# EAGLE design FinalAQsensors (EAGLE 9.3.1)
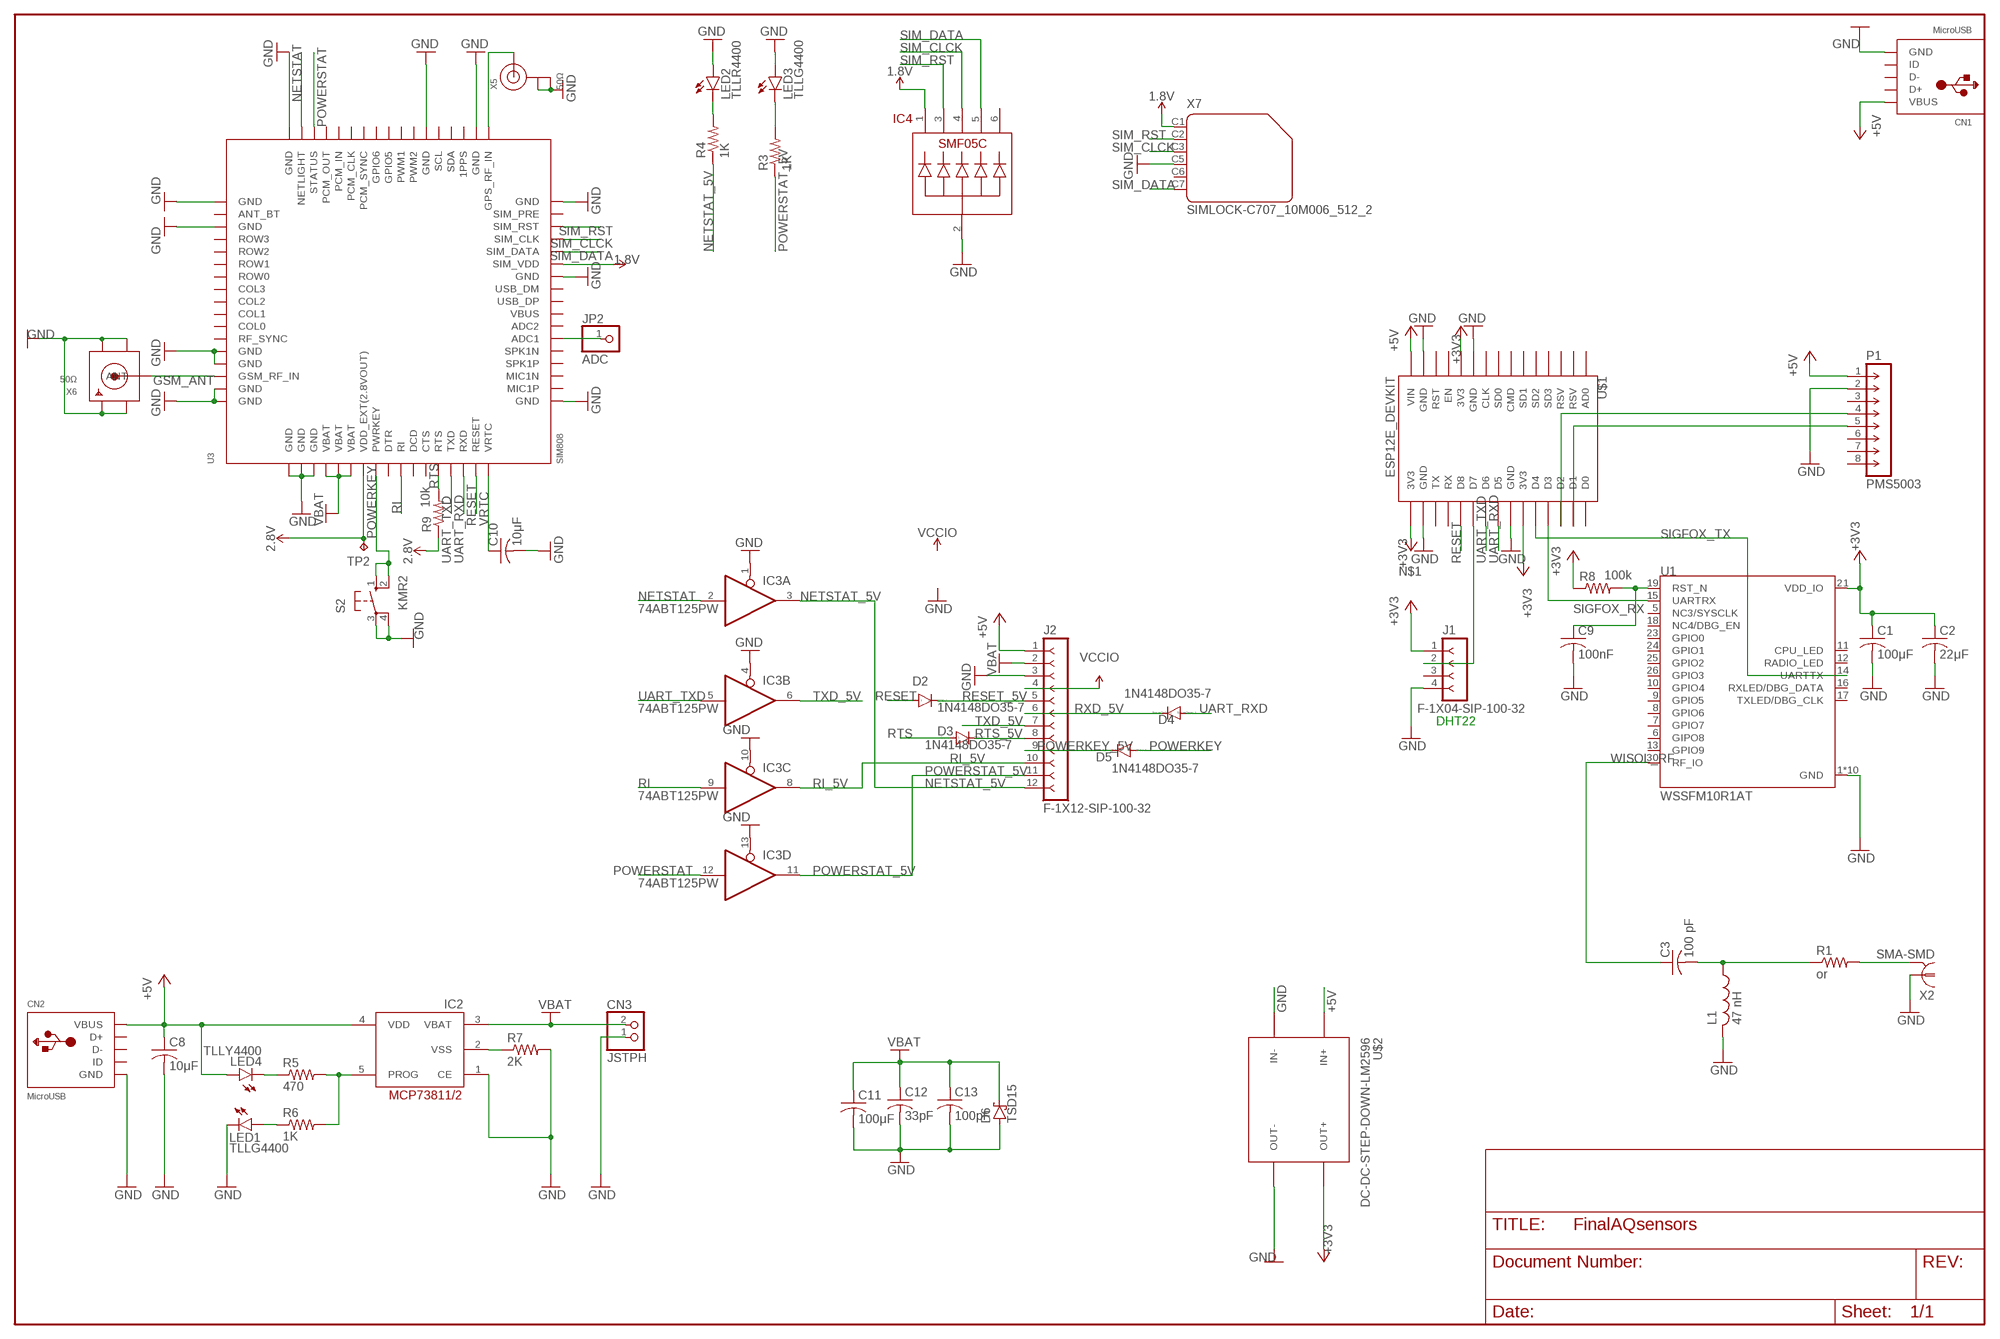
[diagram p0: schematic, sheet 1]

## Parts
C1  100μF  C-USC0201  [C0201]
C2  22μF  C-USC0201  [C0201]
C3  100 pF  C-USC0201  [C0201]
C8  10μF  C-US025-025X050  [C025-025X050]
C9  100nF  C-US025-025X050  [C025-025X050]
C10  10μF  C-USC0402  [C0402]
C11  100μF  C-USC0402  [C0402]
C12  33pF  C-USC0402  [C0402]
C13  100pF  C-USC0402  [C0402]
CN1  MicroUSB  USBMINIB  [USB-MINIB]
CN2  MicroUSB  USBMINIB  [USB-MINIB]
CN3  JSTPH  JST_2PIN-SMT  [JST-PH-2-SMT]
D2  1N4148DO35-7  [DO35-7]
D3  1N4148DO35-7  [DO35-7]
D4  1N4148DO35-7  [DO35-7]
D5  1N4148DO35-7  [DO35-7]
D6  TSD15  [CB429-15]
IC2  MCP73811/2  [SOT23-5L]
IC3  74ABT125PW  [TSSOP14]
IC4  SMF05C  [SC-70-6]
J1  F-1X04-SIP-100-32  [SIP-100-04-32]
J2  F-1X12-SIP-100-32  [SIP-100-12-32]
JP2  ADC  PINHD-1X01_2.00  [1X01M]
L1  47 nH  L-US0204/7  [0204/7]
LED1  TLLG4400  [LED3MM]
LED2  TLLR4400  [LED3MM]
LED3  TLLG4400  [LED3MM]
LED4  TLLY4400  [LED3MM]
P1  PMS5003  M-1X08-SIP-100-40  [SIP-100-08-40]
R1  or  R-US_0204/5  [0204/5]
R3  1K  R-US_0204/5  [0204/5]
R4  1K  R-US_0204/5  [0204/5]
R5  470  R-US_0204/5  [0204/5]
R6  1K  R-US_0204/5  [0204/5]
R7  2K  R-US_0204/5  [0204/5]
R8  100k  R-US_0204/7  [0204/7]
R9  10k  R-US_0204/5  [0204/5]
S2  KMR2  40/XX  [B3F/40XX]
TP2  TPTP10R  [TP10R]
U1  WSSFM10R1AT  [XCVR_WSSFM10R1AT]
U3  SIM808  GSM_SIM808_LITERAL  [SIM900_SMT]
U$1  ESP12E_DEVKIT  [ESP12E_DEVKIT]
U$2  DC-DC-STEP-DOWN-LM2596  [DC-DC-STEP-DOWN-LM2596]
X2  SMA-SMD  [SMA-SMD]
X5  50Ω  ANTENNA_U.FL  [U.FL]
X6  50Ω  SMACONNECTOR_EDGE_UFL  [SMA_EDGELAUNCH_UFL]
X7  SIMLOCK-C707_10M006_512_2  [C707_10M006_512_2]

## Nets
1.8V: IC4.1 U3.P$29(SIM_VDD) X7.C1
2.8V: R9.1 TP2.TP U3.P$7(VDD_EXT(2.8VOUT))
+3V3: C1.1 C2.1 J1.1 R8.1 U1.21(VDD_IO) U$1.3V3@0(3V3) U$1.3V3@1(3V3) U$1.3V3@2(3V3) U$2.OUT+
+5V: C8.1 CN1.VBUS CN2.VBUS IC2.4(VDD) J2.1 LED4.A P1.1 U$1.VIN U$2.IN+
GND [GND]: C1.2 C2.2 C8.2 C9.2 C10.2 C11.2 C12.2 C13.2 CN1.GND CN2.GND CN3.1 D6.A IC2.1(CE) IC3.1(A:OE) IC3.4(B:OE) IC3.10(C:OE) IC3.13(D:OE) IC4.2 J1.4 J2.3 L1.2 LED1.K(C) LED2.A LED3.A P1.2 R7.2 S2.3(P) S2.4(P1) U1.1(GND) U1.2(GND) U1.3(GND) U1.4(GND) U1.20(GND) U1.22(GND) U1.27(GND) U1.28(GND) U1.29(GND) U1.31(GND) U3.P$1(GND) U3.P$2(GND) U3.P$3(GND) U3.P$18(GND) U3.P$28(GND) U3.P$34(GND) U3.P$36(GND) U3.P$40(GND) U3.P$51(GND) U3.P$52(GND) U3.P$54(GND) U3.P$64(GND) U3.P$65(GND) U3.P$67(GND) U3.P$68(GND) U$1.GND@0(GND) U$1.GND@1(GND) U$1.GND@2(GND) U$1.GND@3(GND) U$2.IN- U$2.OUT- X2.1 X5.1(GND) X5.2(GND) X6.GND@1(GND1) X6.GND@2(GND2) X6.GND@3(GND3) X6.GND@4(GND4) X7.C5
GSM_ANT: U3.P$66(GSM_RF_IN) X6.P(ANT)
N$1: J1.2 U$1.D7
N$2: C9.1 R8.2 U1.19(RST_N)
N$3: P1.4 U$1.D2
N$4: P1.5 U$1.D1
N$5: C3.2 L1.1 R1.1
N$6: U3.P$35(GPS_RF_IN) X5.3(SIGNAL)
N$12: R1.2 X2.2@1 X2.2@2 X2.2@3 X2.2@4 X2.2@5 X2.2@6
N$13: JP2.1 U3.P$23(ADC1)
N$18: LED2.K(C) R4.2
N$21: LED3.K(C) R3.2
N$35: LED4.K(C) R5.1
N$36: IC2.5(PROG) R5.2 R6.2
N$37: LED1.A R6.1
NETSTAT: IC3.2(A:I) U3.P$50(NETLIGHT)
NETSTAT_5V: IC3.3(A:O) J2.12 R4.1
POWERKEY: D5.A S2.1(S) S2.2(S1) U3.P$8(PWRKEY)
POWERKEY_5V: D5.C J2.9
POWERSTAT: IC3.12(D:I) U3.P$49(STATUS)
POWERSTAT_5V: IC3.11(D:O) J2.11 R3.1
RESET: D2.A U3.P$16(RESET) U$1.D8
RESET_5V: D2.C J2.5
RI: IC3.9(C:I) U3.P$10(RI)
RI_5V: IC3.8(C:O) J2.10
RTS: D3.A R9.2 U3.P$13(RTS)
RTS_5V: D3.C J2.8
RXD_5V: D4.C J2.6
SIGFOX_RX: U1.15(UARTRX) U$1.D3
SIGFOX_TX: U1.14(UARTTX) U$1.D4
SIM_CLCK: IC4.4 U3.P$31(SIM_CLK) X7.C3
SIM_DATA: IC4.5 U3.P$30(SIM_DATA) X7.C7
SIM_RST: IC4.3 U3.P$32(SIM_RST) X7.C2
TXD_5V: IC3.6(B:O) J2.7
UART_RXD: D4.A U3.P$15(RXD) U$1.D5
UART_TXD: IC3.5(B:I) U3.P$14(TXD) U$1.D6
VBAT: C11.1 C12.1 C13.1 CN3.2 D6.C IC2.3(VBAT) J2.2 U3.P$4(VBAT) U3.P$5(VBAT) U3.P$6(VBAT)
VCCIO: J2.4
VRTC: C10.1 U3.P$17(VRTC)
VSS: IC2.2(VSS) R7.1
WISOL_RF: C3.1 U1.30(RF_IO)
Unconnected: CN1.D+ CN1.D- CN1.ID CN2.D+ CN2.D- CN2.ID IC4.6 J1.3 P1.3 P1.6 P1.7 P1.8 U1.5(NC3/SYSCLK) U1.6(GIPO8) U1.7(GPIO7) U1.8(GPIO6) U1.9(GPIO5) U1.10(GPIO4) U1.11(CPU_LED) U1.12(RADIO_LED) U1.13(GPIO9) U1.16(RXLED/DBG_DATA) U1.17(TXLED/DBG_CLK) U1.18(NC4/DBG_EN) U1.23(GPIO0) U1.24(GPIO1) U1.25(GPIO2) U1.26(GPIO3) U3.P$9(DTR) U3.P$11(DCD) U3.P$12(CTS) U3.P$19(MIC1P) U3.P$20(MIC1N) U3.P$21(SPK1P) U3.P$22(SPK1N) U3.P$24(ADC2) U3.P$26(USB_DP) U3.P$27(USB_DM) U3.P$33(SIM_PRE) U3.P$37(1PPS) U3.P$38(SDA) U3.P$39(SCL) U3.P$41(PWM2) U3.P$42(PWM1) U3.P$43(GPIO5) U3.P$44(GPIO6) U3.P$45(PCM_SYNC) U3.P$46(PCM_CLK) U3.P$47(PCM_IN) U3.P$48(PCM_OUT) U3.P$53(ANT_BT) U3.P$55(ROW3) U3.P$56(ROW2) U3.P$57(ROW1) U3.P$58(ROW0) U3.P$59(COL3) U3.P$60(COL2) U3.P$61(COL1) U3.P$62(COL0) U3.P$63(RF_SYNC) U$1.AD0 U$1.CLK U$1.CMD U$1.D0 U$1.EN U$1.RST U$1.RSV@0(RSV) U$1.RSV@1(RSV) U$1.RX U$1.SD0 U$1.SD1 U$1.SD2 U$1.SD3 U$1.TX X7.C6

## Notes on the sheet
- DHT22

## Power pins joined to a net without a drawn wire
GND: IC3.7(P:GND)
VBUS: U3.P$25(VBUS)
VCC: IC3.14(P:VCC)

## Library data of the parts
C1-C3 C9-C13 = rcl:C-US: CAPACITOR, American symbol; SPICEPREFIX: C
C8 = adafruit:C-US: CAPACITOR, American symbol
CN1 CN2 = adafruit:USB: USB Connectors USBMINIB - Surface Mount Female Mini-B USB Connector 4UConnector: 06564 By microbuilder.eu Thru-hole RA Female Mini-B USB Connector 4UConnector: 18732 By ladyada.net
CN3 = adafruit:JST_2PIN: JST 2-Pin Connectors of various flavors SMT-RA (S2B-PH-SM4) 4UConnector #17311 SMT (B2B-PH-SM4) THM-RA (S2B-PH) THM (B2B-PH)
D2-D5 = diode:1N4148: DIODE high speed (Philips)
D6 = diode:TSD15: DIODE
IC2 = adafruit:MCP73811/2: MCP73811 and MCP73812 Simple, Miniature Single-Cell, Fully Integrated Li-Ion / Li-Polymer Charge Management Controllers SOT-23-5 package, no indicator LED but with adjustable current, small and very inexpensive
IC3 = 74xx-eu:74*125: Quad bus BUFFER, 3-state
IC4 = smf05c:SMF05C
J1 = con-headers-jp:F-1X04-: FEMALE HEADER
J2 = con-headers-jp:F-1X12-: FEMALE HEADER
JP2 = pinhead-2:PINHD-1X01: PIN HEADER
L1 = rcl:L-US: INDUCTOR, American symbol; SPICEPREFIX: L
LED1 LED3 = led:TLLG4400: Low Current (2mA) LED 3 mm Tinted Diffused Package color GREEN Source: Data sheet <http://www.farnell.com/datasheets/391098.pdf>; MF: VISHAY SEMICONDUCTOR; OC_FARNELL: 1612435
LED2 = led:TLLR4400: Low Current (2mA) LED 3 mm Tinted Diffused Package color RED Source: Data sheet <http://www.farnell.com/datasheets/391100.pdf>; MF: VISHAY SEMICONDUCTOR; OC_FARNELL: 1612437
LED4 = led:TLLY4400: Low Current (2mA) LED 3 mm Tinted Diffused Package color YELLOW Source: Data sheet <http://www.farnell.com/datasheets/391098.pdf>; MF: VISHAY SEMICONDUCTOR; OC_FARNELL: 1612439
P1 = con-headers-jp:M-1X08-: MALE HEADER
R1 R3-R9 = rcl:R-US_: RESISTOR, American symbol; SPICEPREFIX: R
S2 = switch-omron:40/XX: OMRON SWITCH; OC_FARNELL: unknown; OC_NEWARK: unknown
TP2 = testpad:TP: Test pad
U1 = WSSFM10R1AT:WSSFM10R1AT: Sigfox RF Module, Sub-1GHz , SMD; AVAILABILITY: Unavailable; DESCRIPTION: Sigfox Module Rcz1 At Version; MF: Avnet Design Services; MP: WSSFM10R1AT; PACKAGE: None; PRICE: None
U3 = adafruit:GSM_SIM808_LITERAL: SIM808 GSM Module
U$1 = ESP12E_DEVKIT:ESP12E_DEVKIT: ESP12E DEVKIT BOARD
U$2 = diy-modules:DC-DC-STEP-DOWN-LM2596: DC/DC Step-Down Regulator based on LM2596-ADJ chip LM2596 datasheet available here: http://www.ti.com/lit/ds/symlink/lm2596.pdf Click here to find device on ebay.com <http://www.ebay.com/sch/lm2596+power+regulator>
X2 = con-coax:SMA-SMD: SMA 50 Ohm Straight Jack Receptacle - Surface Mount www.johnsoncomponents.com Source: http://catalog.digikey.com .. 142-0711-201, 205, 202, 206.pdf; OC_FARNELL: unknown; OC_NEWARK: unknown
X5 = adafruit:ANTENNA_U.FL: U.FL Antenna Connector
X6 = adafruit:SMACONNECTOR: SMA Connector 90° DIP SMA Connector, 50 Ohm (4UConnector: 07259)
X7 = con-amphenol:SIMLOCK-C707_10M006_512_2: C707A SIMLOCK® 2.5 mm with wide solder tails Source: Data sheet <http://www.amphenol.info/downloads/C707_10M006_512_2.pdf>; OC_FARNELL: unknown; OC_NEWARK: unknown

## Net classes
1 POWER: width 0.508 mm
2 GND: width 0.254 mm

## Board
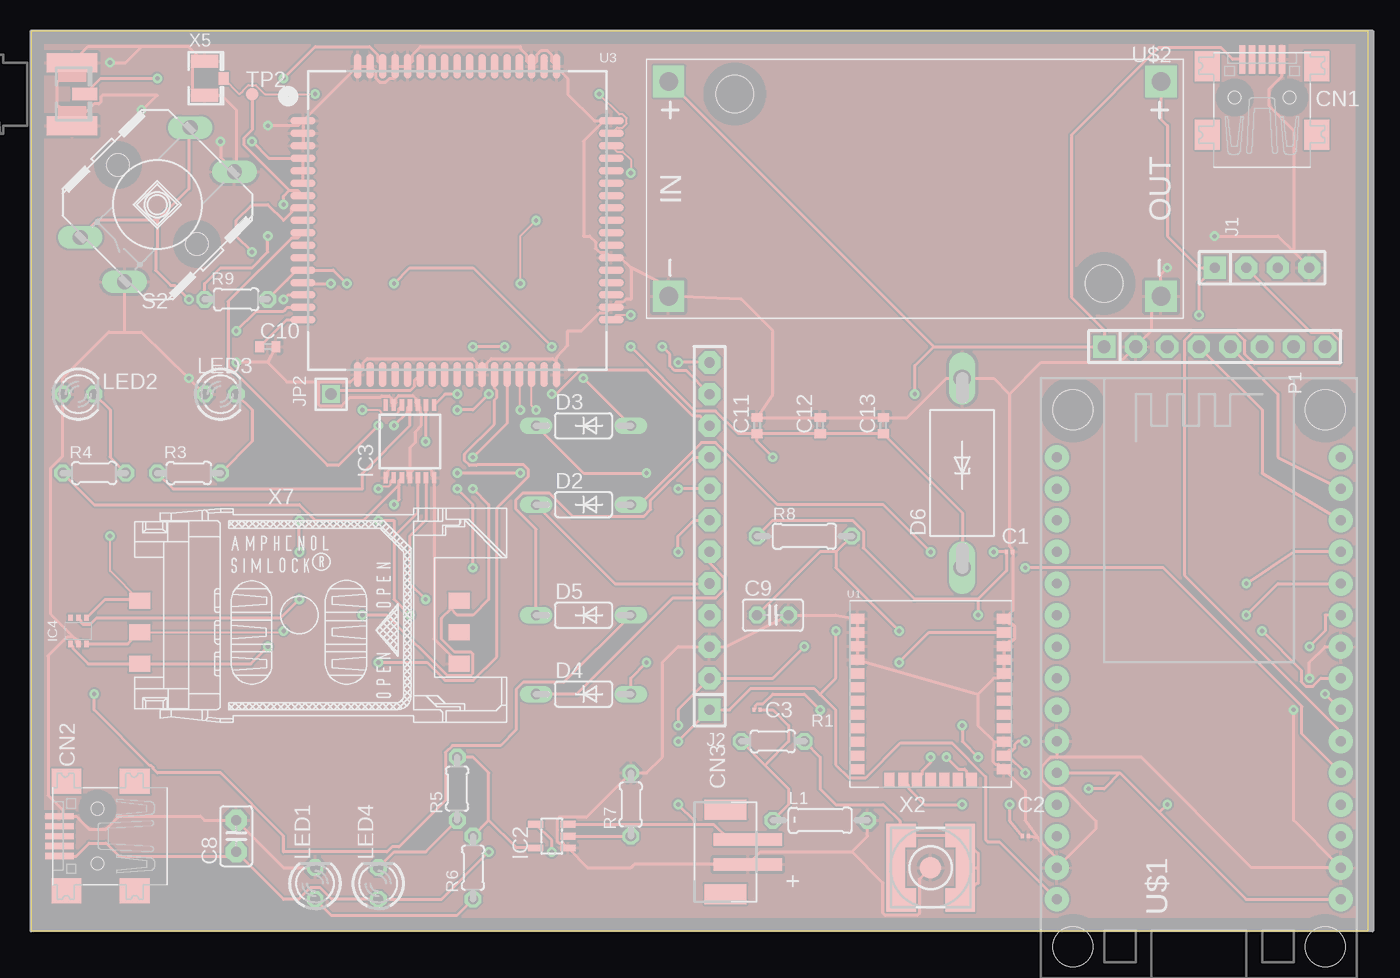
[diagram p1: board, top side]
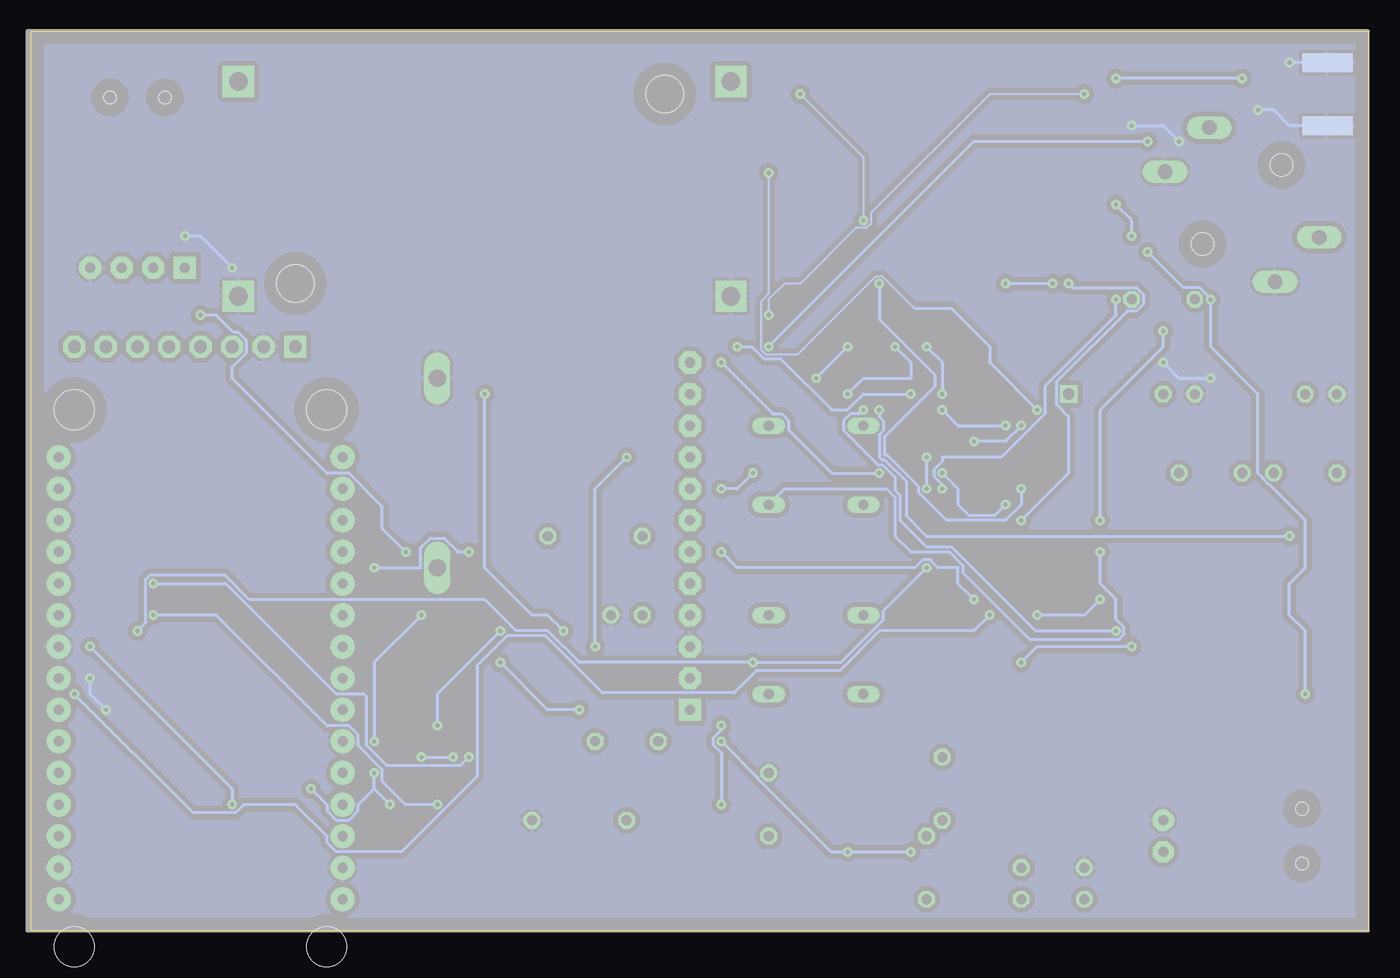
[diagram p2: board, bottom side, seen from below]

Size 107.62 x 72.38 mm. Coordinates in mm from the lower left corner, seen from the top.
Outline: 0,0 107.62,0 107.62,72.38 0,72.38 0,0
Copper layers (1*16): Top 0.035mm / dielectric 1.5mm / Bottom 0.035mm
Design rules "default": minimum track width 6mil, minimum drill 0.35mm, track to track 6mil, track to pad 6mil, pad to pad 6mil, via to via 6mil, smd to smd 6mil, copper to edge 40mil, drill to drill 6mil, minimum pad ring 10mil, minimum via ring 8mil, stop-mask expansion 4mil, vias tented up to drill 0mil, thermal gap 10mil

### Footprints (pad centres in the part's own frame; a part is rotated, then mirrored left to right if it is on the bottom)
C0201 = smd 0.25 x 0.35: 1 -0.25,0; 2 0.25,0
C025-025X050 = drill 0.813 pad 1.676 octagon: 1 -1.27,0; 2 1.27,0
C025-025X050' = drill 0.813 octagon: 1 -1.27,0; 2 1.27,0
C0402 = smd 0.7 x 0.9: 1 -0.65,0; 2 0.65,0
USB-MINIB = smd 0.5 x 2.308: D+ 0,4.064; D- -0.8,4.064; GND 1.6,4.064; ID 0.8,4.064; VBUS -1.6,4.064 | smd 2 x 2.4: GND1 -4.4,-2; GND2 -4.4,3.5; GND3 4.4,3.5; GND4 4.4,-2 | hole 1: -2.2,1; 2.2,1
JST-PH-2-SMT = smd 1 x 5.5: 1 -1,-1.8; 2 1,-1.8 | smd 1.6 x 3.4: NC1 -3.4,0; NC2 3.4,0
DO35-7 = drill 0.813 long: A 3.81,0; C -3.81,0
CB429-15 = drill 1.397 long: A 7.62,0; C -7.62,0
SOT23-5L = smd 0.55 x 1.2: 1 -0.95,-1.3; 2 0,-1.3; 3 0.95,-1.3; 4 0.95,1.3; 5 -0.95,1.3
TSSOP14 = smd 0.35 x 0.9: 1 -1.95,-2.925; 2 -1.3,-2.925; 3 -0.65,-2.925; 4 0,-2.925; 5 0.65,-2.925; 6 1.3,-2.925; 7 1.95,-2.925; 8 1.95,2.925; 9 1.3,2.925; 10 0.65,2.925; 11 0,2.925; 12 -0.65,2.925; 13 -1.3,2.925; 14 -1.95,2.925
SC-70-6 = smd 0.35 x 0.5: 1 -0.65,-1.05; 2 0,-1.05; 3 0.65,-1.05; 4 0.65,1.05; 5 0,1.05; 6 -0.65,1.05
SIP-100-04-32 = drill 0.813 pad 1.778 square: 1 -3.81,0 | drill 0.813 pad 1.778 octagon: 2 -1.27,0; 3 1.27,0; 4 3.81,0
SIP-100-12-32 = drill 0.813 pad 1.778 square: 1 -13.97,0 | drill 0.813 pad 1.778 octagon: 2 -11.43,0; 3 -8.89,0; 4 -6.35,0; 5 -3.81,0; 6 -1.27,0; 7 1.27,0; 8 3.81,0; 9 6.35,0; 10 8.89,0; 11 11.43,0; 12 13.97,0
1X01M = drill 0.914 square: 1 0,0
0204/7 = drill 0.813 octagon: 1 -3.81,0; 2 3.81,0
LED3MM = drill 0.813 octagon: A -1.27,0; K 1.27,0
SIP-100-08-40 = drill 1.016 pad 1.778 square: 1 -8.89,0 | drill 1.016 pad 1.778 octagon: 2 -6.35,0; 3 -3.81,0; 4 -1.27,0; 5 1.27,0; 6 3.81,0; 7 6.35,0; 8 8.89,0
0204/5 = drill 0.813 octagon: 1 -2.54,0; 2 2.54,0
B3F/40XX = drill 1.194 long: 1 -6.198,-2.642; 2 2.642,6.198; 3 -2.642,-6.198; 4 6.198,2.642 | hole 1.803: -3.175,3.175; 3.175,-3.175
TP10R = smd 1 x 1: TP 0,0
XCVR_WSSFM10R1AT = smd 1.15 x 0.81: 1 -5.9,6.05; 2 -5.9,4.95; 3 -5.9,3.85; 4 -5.9,2.75; 5 -5.9,1.65; 6 -5.9,0.55; 7 -5.9,-0.55; 8 -5.9,-1.65; 9 -5.9,-2.75; 10 -5.9,-3.85; 11 -5.9,-4.95; 12 -5.9,-6.05; 20 5.9,-6.05; 21 5.9,-4.95; 22 5.9,-3.85; 23 5.9,-2.75; 24 5.9,-1.65; 25 5.9,-0.55; 26 5.9,0.55; 27 5.9,1.65; 28 5.9,2.75; 29 5.9,3.85; 30 5.9,4.95; 31 5.9,6.05 | smd 0.81 x 1.15: 13 -3.3,-6.9; 14 -2.2,-6.9; 15 -1.1,-6.9; 16 0,-6.9; 17 1.1,-6.9; 18 2.2,-6.9; 19 3.3,-6.9
SIM900_SMT = smd 2 x 0.6: P$1 -12.4,8; P$2 -12.4,7; P$3 -12.4,6; P$4 -12.4,5; P$5 -12.4,4; P$6 -12.4,3; P$7 -12.4,2; P$8 -12.4,1; P$9 -12.4,0; P$10 -12.4,-1; P$11 -12.4,-2; P$12 -12.4,-3; P$13 -12.4,-4; P$14 -12.4,-5; P$15 -12.4,-6; P$16 -12.4,-7; P$17 -12.4,-8; P$35 12.4,-8; P$36 12.4,-7; P$37 12.4,-6; P$38 12.4,-5; P$39 12.4,-4; P$40 12.4,-3; P$41 12.4,-2; P$42 12.4,-1; P$43 12.4,0; P$44 12.4,1; P$45 12.4,2; P$46 12.4,3; P$47 12.4,4; P$48 12.4,5; P$49 12.4,6; P$50 12.4,7; P$51 12.4,8 | smd 0.6 x 2: P$18 -8,-12.4; P$19 -7,-12.4; P$20 -6,-12.4; P$21 -5,-12.4; P$22 -4,-12.4; P$23 -3,-12.4; P$24 -2,-12.4; P$25 -1,-12.4; P$26 0,-12.4; P$27 1,-12.4; P$28 2,-12.4; P$29 3,-12.4; P$30 4,-12.4; P$31 5,-12.4; P$32 6,-12.4; P$33 7,-12.4; P$34 8,-12.4; P$52 8,12.4; P$53 7,12.4; P$54 6,12.4; P$55 5,12.4; P$56 4,12.4; P$57 3,12.4; P$58 2,12.4; P$59 1,12.4; P$60 0,12.4; P$61 -1,12.4; P$62 -2,12.4; P$63 -3,12.4; P$64 -4,12.4; P$65 -5,12.4; P$66 -6,12.4; P$67 -7,12.4; P$68 -8,12.4
ESP12E_DEVKIT = drill 0.8 pad 1.93: 3V3@0 -11.43,-7.62; 3V3@1 11.43,5.08; 3V3@2 11.43,-17.78; AD0 -11.43,17.78; CLK -11.43,-2.54; CMD -11.43,2.54; D0 11.43,17.78; D1 11.43,15.24; D2 11.43,12.7; D3 11.43,10.16; D4 11.43,7.62; D5 11.43,0; D6 11.43,-2.54; D7 11.43,-5.08; D8 11.43,-7.62; EN -11.43,-10.16; GND@0 -11.43,-5.08; GND@1 -11.43,-15.24; GND@2 11.43,2.54; GND@3 11.43,-15.24; RST -11.43,-12.7; RSV@0 -11.43,15.24; RSV@1 -11.43,12.7; RX 11.43,-10.16; SD0 -11.43,0; SD1 -11.43,5.08; SD2 -11.43,7.62; SD3 -11.43,10.16; TX 11.43,-12.7; VIN -11.43,-17.78 | hole 3.2: -10.16,21.59; 10.16,21.59; 10.16,-21.59; -10.16,-21.59
DC-DC-STEP-DOWN-LM2596 = drill 1.5 pad 2.5 square: IN+ -19.812,8.636; IN- -19.812,-8.636; OUT+ 19.812,8.636; OUT- 19.812,-8.636 | hole 3: -14.478,7.62; 15.24,-7.62
SMA-SMD = smd 1.73 x 1.73: 1 0,0 | smd 2.35 x 1.9: 2@1 -2.375,2.6; 2@2 -2.375,-2.6; 2@3 2.375,-2.6; 2@4 2.375,2.6 | smd 1.5 x 3.4: 2@5 -2.8,0; 2@6 2.8,0
U.FL = smd 2.2 x 1.05: 1 0,1.375; 2 0,-1.375 | smd 0.8 x 1: 3 1.525,0
SMA_EDGELAUNCH_UFL = smd 4.064 x 1.524: GND@1 2.032,-2.54; GND@2 2.032,2.54 | smd 4.064 x 1.524 bottom: GND@3 2.032,2.54; GND@4 2.032,-2.54 | smd 2.032 x 1.016: P 3.048,0
C707_10M006_512_2 = smd 1.7 x 1.3: C1 -12.85,-3.915; C2 -12.85,-1.375; C3 -12.85,1.165; C5 12.85,-3.915; C6 12.85,-1.375; C7 12.85,1.165

### Placement (x,y rotation side)
C1  78.74,30.48 0 top
C2  80.01,7.62 0 top
C3  58.42,17.78 0 top
C8  16.51,7.62 90 top
C9  100nF  [C025-025X050']  59.69,25.4 0 top
C10  19.05,46.99 0 top
C11  58.42,40.64 90 top
C12  63.5,40.64 90 top
C13  68.58,40.64 90 top
CN1  99.06,66.04 0 top
CN2  6.35,7.62 90 top
CN3  55.88,6.35 90 top
D2  44.45,34.29 0 top
D3  44.45,40.64 0 top
D4  44.45,19.05 0 top
D5  44.45,25.4 0 top
D6  74.93,36.83 90 top
IC2  41.91,7.62 90 top
IC3  30.48,39.37 0 top
IC4  3.81,24.13 0 top
J1  99.06,53.34 0 top
J2  54.61,31.75 90 top
JP2  24.13,43.18 0 top
L1  63.5,8.89 0 top
LED1  22.86,3.81 90 top
LED2  3.81,43.18 0 top
LED3  15.24,43.18 0 top
LED4  27.94,3.81 90 top
P1  95.25,46.99 0 top
R1  59.69,15.24 0 top
R3  12.7,36.83 0 top
R4  5.08,36.83 0 top
R5  34.29,11.43 90 top
R6  35.56,5.08 90 top
R7  48.26,10.16 90 top
R8  62.23,31.75 0 top
R9  16.51,50.8 0 top
S2  10.16,58.42 0 top
TP2  17.78,67.31 0 top
U1  72.39,19.05 0 top
U3  34.29,57.15 0 top
U$1  93.98,20.32 0 top
U$2  71.12,59.69 0 top
X2  72.39,5.08 0 top
X5  13.97,68.58 0 top
X6  1.27,67.31 0 top
X7  21.59,25.4 0 top

### Tracks (layer width: path | path; a pad name or v marks a point on that pad's centre or on a via)
1.8V  (via drill 0.35)
  Top 0.254: IC4.1 3.36,22.88 3.36,22.71 4.58,21.48 X7.C1 17.68,21.48 v19.05,22.86 | v27.94,21.59 31.86,21.59 33.31,20.15 35.57,20.15 37.49,22.06 37.49,34.02 40.03,36.56 40.03,37.1 39.64,37.49 35.88,37.49 35.83,37.44 35.29,37.44 34.9,37.83 34.9,38.37 37.29,40.76 37.29,42.71 37.49,42.91 37.49,43.45 37.29,43.65 U3.P$29
  Bottom 0.254: v19.05,22.86 26.67,22.86 v27.94,21.59
2.8V  (via drill 0.35)
  Top 0.254: U3.P$7 21.47,59.57 20.78,59.57 | TP2.TP 17.78,64.43 17.12,63.77 17.12,63.23 20.78,59.57 | R9.1 13.97,52.07 15.24,53.34 17.78,53.34 19.05,54.61 v19.05,55.88 | v20.32,58.42 20.32,59.11 20.78,59.57
  Bottom 0.254: v19.05,55.88 19.05,57.15 v20.32,58.42
+3V3  (via drill 0.35)
  Top 0.254: R8.1 59.69,33.02 66.1,33.02 66.98,32.14 66.98,30.81 71.12,26.67 76.2,26.67 | 76.2,26.67 78.49,28.96 C1.1 v77.47,30.48 | U$1.3V3@0 87.63,12.7 | 87.63,12.7 90.81,9.53 | 90.81,9.53 97.79,2.54 U$1.3V3@2 | U$1.3V3@1 104.14,25.4 104.14,24.13 v102.87,22.86 | U$2.OUT+ 90.93,65.28 91.44,64.77 91.44,55.88 93.98,53.34 J1.1 93.98,52.07 v93.98,49.53 | v91.44,10.16 90.81,9.53 | 87.63,12.7 86.36,11.43 v85.09,11.43 | v80.01,12.7 78.61,14.1 U1.21 78.71,14.52 78.98,14.52 79.14,14.68 79.14,14.95 79.43,15.24 v80.01,15.24 | 76.2,26.67 v76.2,25.4 | v78.74,10.16 78.74,8.89 C2.1
  Bottom 0.254: v102.87,22.86 91.44,11.43 v91.44,10.16 | v77.47,30.48 79.35,32.36 79.35,34.12 82.03,36.8 83.8,36.8 91.44,44.45 91.44,45.34 90.27,46.51 90.27,47.47 90.96,48.16 91.34,48.16 92.71,49.53 v93.98,49.53 | v78.74,10.16 80.01,11.43 | 80.01,11.43 v80.01,12.7 | v85.09,11.43 83.8,10.13 83.8,9.64 83.07,8.91 82.03,8.91 81.31,9.64 81.31,10.13 80.01,11.43 | v76.2,25.4 80.01,21.59 v80.01,15.24
+5V  (via drill 0.35)
  Top 0.254: U$1.VIN 77.92,7.17 76.98,7.17 76.82,7.33 76.82,12.4 74.1,15.11 69.98,15.11 67.18,12.32 65.8,12.32 64.73,13.38 64.73,17.78 63.48,19.03 | 63.48,19.03 63.01,19.5 57.93,19.5 56.2,17.78 J2.1 v52.07,15.24 | U$2.IN+ 72.64,46.99 | 72.64,46.99 P1.1 86.36,48.33 83.72,50.98 83.72,64.01 90.73,71.02 95.78,71.02 96.69,70.1 CN1.VBUS | v36.83,6.35 33.02,2.54 LED4.A 24.19,2.54 23.25,3.48 22.47,3.48 21.53,2.54 20.32,2.54 C8.1 16.18,6.02 7.07,6.02 6.03,7.06 4.67,7.06 3.63,6.02 CN2.VBUS | IC2.4 41.91,7.27 v41.91,6.35 | 63.48,19.03 64.77,20.32 v64.77,24.13 | v71.12,43.18 71.12,45.47 72.64,46.99
  Bottom 0.254: v52.07,15.24 49.2,12.37 49.2,12.31 43.24,6.35 v41.91,6.35 v36.83,6.35 | v64.77,24.13 66.04,25.4 67.31,25.4 71.12,29.21 v71.12,43.18
GND  (via drill 0.35)
  Top 0.254: 78.74,43.18 77.47,44.45 D6.A 73.66,44.45 70.5,41.29 C13.2 C12.2 C11.2 59.69,43.18 59.69,48.26 57.15,50.8 U$2.IN- 50.8,52.07 48.26,53.34 | 78.74,43.18 78.74,30.93 78.89,30.77 78.89,30.58 C1.2 78.99,25.8 U1.31 78.71,24.68 78.98,24.68 79.14,24.52 79.14,23.48 78.98,23.32 78.71,23.32 U1.29 U1.28 U1.27 77.91,20.32 77.47,20.32 76.2,19.05 | 76.2,19.05 76.2,16.51 77.51,15.2 | 77.51,15.2 U1.22 | 77.51,15.2 77.51,14.7 77.44,14.62 77.44,13.58 77.6,13.42 77.87,13.42 U1.20 80.01,11.28 80.01,8.89 81.05,7.45 | CN2.GND 2.54,9.22 | 2.54,9.22 3.63,9.22 4.67,8.18 6.03,8.18 7.07,9.22 13.64,9.22 13.97,8.89 C8.2 20.32,5.08 LED1.K | 66.04,6.35 58.68,6.35 CN3.1 48.53,5.35 48.26,5.08 44.8,5.08 IC2.1 42.81,7.07 42.49,7.07 42.33,7.23 42.33,8.96 42.49,9.12 44.68,9.12 R7.2 49.53,12.7 50.8,13.97 50.8,21.59 52.07,22.86 J2.3 55.88,22.86 C9.2 64.77,25.4 U1.1 U1.2 U1.3 U1.4 76.2,19.05 | 66.04,6.35 67.31,7.62 L1.2 | 7.52,48.16 S2.3 | 7.52,48.16 6.25,48.16 2.54,44.45 LED2.A 2.54,38.16 1.6,37.22 1.6,25.46 3.45,23.61 | 7.52,48.16 8.89,48.16 v12.7,44.45 LED3.A | 16.51,61.21 S2.4 | 16.51,61.21 16.51,66.04 15.35,67.2 X5.2 13.55,67.63 13.03,67.63 12.95,67.7 12.95,69.46 13.03,69.53 13.55,69.53 X5.1 13.87,69.95 12.7,71.12 8.89,71.12 | U3.P$1 U3.P$2 U3.P$3 | 48.26,53.34 47.45,54.15 U3.P$40 46.27,54.57 45.75,54.57 45.41,54.91 45.41,55.43 44.96,55.88 44.45,55.88 44.45,63.5 46.1,65.15 U3.P$51 45.34,65.15 43.18,67.31 43.18,68.58 42.29,69.47 U3.P$52 41.87,69.97 41.87,70.49 41.53,70.83 41.05,70.83 40.71,70.49 40.71,69.97 U3.P$54 39.87,69.97 39.87,70.49 39.37,70.99 39.37,71.12 31.34,71.12 30.71,70.49 30.71,69.97 U3.P$64 U3.P$65 29.29,68.66 29.21,68.58 28.84,68.58 28.53,68.27 28.05,68.27 27.71,68.61 27.71,69.13 U3.P$67 U3.P$68 U3.P$1
  Top 0.254: 48.26,53.34 48.26,50.8 47.86,50.8 47.63,50.57 47.11,50.57 U3.P$36 46.27,49.73 45.75,49.73 44.28,48.26 43.18,48.26 43.18,47.1 42.29,46.13 42.29,45.72 | U3.P$34 42.29,45.72 | IC3.1 28.73,36.64 28.73,37.01 28.89,37.17 30.12,37.17 30.28,37.01 30.28,36.64 30.29,36.64 | 30.29,36.64 IC3.4 30.48,38.84 30.89,39.25 30.89,40.1 31.37,40.64 31.37,41.68 31.33,41.73 31.33,42.1 IC3.10 30.93,42.49 30.93,42.86 30.73,43.06 29.58,43.06 29.38,42.86 29.38,42.49 IC3.13 28.98,42.49 28.98,42.86 28.82,43.02 28.24,43.02 28.12,42.91 25.67,42.91 24.96,42.19 23.3,42.19 23.14,42.35 23.14,44.01 23.3,44.17 | CN1.GND 100.66,68.76 99.62,67.72 99.62,66.36 101.6,64.38 101.6,54.61 | 101.6,54.61 J1.4 | 82.55,13.95 89.34,13.95 98.2,5.08 U$1.GND@3 101.6,8.89 v101.6,17.78 | 82.55,13.95 82.03,13.95 81.31,13.22 81.31,12.18 82.03,11.46 83.07,11.46 85.69,8.83 85.69,8.22 U$1.GND@1 82.55,5.86 81.31,7.1 81.05,7.45 | U$1.GND@0 82.55,13.95 | C10.2 19.05,45.72 | 3.45,23.61 2.87,23.61 1.37,22.11 1.37,10.9 2.54,9.73 2.54,9.22 | 3.61,23.45 3.76,23.3 3.76,23.13 IC4.2 3.61,23.28 3.61,23.45 | X7.C5 32.43,23.5 IC3.7 32.23,36.64 32.23,37.01 32.07,37.17 30.84,37.17 30.68,37.01 30.66,37.01 30.29,36.64 | v102.87,20.32 102.87,21.59 104.14,22.86 U$1.GND@2 | 78.74,43.18 81.28,45.72 87.63,45.72 P1.2 90.17,48.26 90.17,50.8 U$2.OUT- 90.93,52.83 v91.44,53.34 | v95.25,55.88 100.33,55.88 101.6,54.61 | 3.61,23.45 3.45,23.61 | U3.P$1 21.51,64.77 v19.05,64.77 | v15.24,63.5 15.24,62.23 16.26,61.21 16.51,61.21 | 23.3,44.17 25.71,44.17 U3.P$18 26.71,45.17 26.71,45.69 27.05,46.03 35.53,46.03 35.87,45.69 35.87,45.17 U3.P$28 36.71,45.17 36.71,45.69 37.05,46.03 41.98,46.03 42.29,45.72
  Top 0.254: 19.05,45.72 20.6,44.17 23.3,44.17 | 19.05,45.72 v16.51,45.72 | 81.05,7.45 C2.2 | 8.89,71.12 4.57,71.12 X6.GND@3 3.3,69.47 2.06,68.23 2.06,66.39 2.13,66.32 2.26,66.32 3.57,65.01 | 3.57,65.01 5.08,66.52 5.45,66.52 5.61,66.69 5.61,67.08 5.74,67.2 10.16,67.2 8.99,66.04 v8.89,66.04 | 3.57,65.01 3.33,64.77 X6.GND@4 | v6.35,69.85 7.62,69.85 8.89,71.12 | X2.1 71.47,4.16 71.47,1.41 71.31,1.25 68.72,1.25 68.56,1.41 68.56,3.83 66.04,6.35
  Bottom 0.254: v101.6,17.78 102.87,19.05 v102.87,20.32 | v91.44,53.34 93.98,55.88 v95.25,55.88 | v15.24,63.5 16.51,64.77 v19.05,64.77 | v16.51,45.72 15.24,44.45 v12.7,44.45 | X6.GND@4 6.35,64.77 7.62,66.04 v8.89,66.04 | X6.GND@3 v6.35,69.85
  pour Bottom (isolate 0.406): 0,0 0,72.39 107.95,72.39 107.95,0
  pour Top: 0,0 0,72.39 107.95,72.39 107.95,0
GSM_ANT  (via drill 0.35)
  Top 0.254: X6.P 5.59,68.58 v10.16,68.58 | v20.32,68.58 22.86,71.12 27.24,71.12 27.87,70.49 27.87,69.97 U3.P$66
  Bottom 0.254: v10.16,68.58 v20.32,68.58
N$1
  Top 0.254: J1.2 102.97,48.16 104.62,48.16 105.31,47.47 105.31,45.62 98.47,45.62 97.69,46.4 97.69,47.47 97,48.16 93.5,48.16 92.81,47.47 92.81,28.62 105.41,16.02 U$1.D7
N$2  (via drill 0.35)
  Top 0.254: R8.2 64.77,30.48 | 64.77,30.48 63.5,30.48 C9.1 | 64.77,30.48 64.77,29.21 v69.85,24.13 | v74.93,16.51 74.93,15.24 v76.2,13.97 | U1.19 75.48,12.15 75.27,12.36 75.27,12.84 75.11,13 74.63,13 v73.66,13.97
  Bottom 0.254: v69.85,24.13 74.93,19.05 v74.93,16.51 | v76.2,13.97 v73.66,13.97
N$3
  Top 0.254: P1.4 99.06,41.91 99.06,36.83 U$1.D2
N$4
  Top 0.254: U$1.D1 100.33,38.1 100.33,43.18 P1.5
N$5
  Top 0.254: R1.1 59.05,13.34 | 59.05,13.34 60.96,11.43 60.96,10.16 L1.1 | C3.2 59.69,17.78 60.96,16.51 60.96,15.24 59.05,13.34
N$6  (via drill 0.35)
  Top 0.152: X5.3 16.77,67.31 17.05,67.6 17.05,67.61 17.48,68.04 18.08,68.04 18.81,67.31 v22.86,67.31 | v48.26,49.53 47.07,49.53 U3.P$35
  Bottom 0.152: v22.86,67.31 30.48,67.31 40.03,57.76 40.03,56.9 40.39,56.54 41.25,56.54 45.72,52.07 46.99,52.07 48.26,50.8 v48.26,49.53
N$12
  Top 0.254: 69.9,7.57 X2.2@1 X2.2@4 76.2,6.25 76.2,5.08 | 69.9,7.57 69.59,7.25 X2.2@5 69.59,2.9 X2.2@2 | R1.2 63.5,13.97 63.5,11.43 64.77,10.16 68.58,10.16 69.9,8.84 69.9,7.57 | 76.2,5.08 76.2,3.81 76.09,3.81 X2.2@3 | X2.2@6 76.2,5.08
N$13
  Top 0.254: JP2.1 24.42,43.47 30.53,43.47 30.87,43.81 30.87,44.33 U3.P$23
N$18
  Top 0.254: LED2.K 6.35,41.91 6.35,38.1 R4.2
N$21
  Top 0.254: LED3.K 17.78,41.91 17.78,39.37 R3.2
N$35
  Top 0.254: LED4.K 29.21,6.35 31.75,6.35 R5.1
N$36
  Top 0.254: R6.2 36.83,8.89 | 36.83,8.89 36.83,12.7 35.56,13.97 R5.2 | IC2.5 39.05,6.67 36.83,8.89
N$37
  Top 0.254: LED1.A 24.13,1.27 34.29,1.27 R6.1
NETSTAT  (via drill 0.35)
  Top 0.152: U3.P$50 47.16,64.62 47.61,64.62 47.92,64.93 47.92,65.37 47.61,65.68 47.35,65.68 v45.72,67.31 | v40.64,57.15 39.37,55.88 v39.37,52.07 | v27.94,35.56 28.15,35.77 28.8,35.77 28.93,35.9 28.93,36.2 IC3.2
  Bottom 0.152: v45.72,67.31 40.64,62.23 v40.64,57.15
  Bottom 0.254: v39.37,52.07 39.37,49.19 34.9,44.72 34.9,43.81 38.96,39.75 38.96,38.3 38.76,38.3 36.22,35.76 36.22,35.29 33.95,33.02 29.21,33.02 27.94,34.29 v27.94,35.56
NETSTAT_5V  (via drill 0.35)
  Top 0.254: IC3.3 29.63,36.25 29.63,35.88 | R4.1 5.08,34.29 21.59,34.29 22.86,33.02 26.77,33.02 29.63,35.88 | J2.12 v52.07,45.72 | v39.37,36.83 v34.29,36.83 | v29.21,34.29 29.63,34.71 29.63,35.88
  Bottom 0.254: v39.37,36.83 43.18,36.83 46.66,40.31 46.66,41.03 47.21,41.58 47.93,41.58 v52.07,45.72 | v34.29,36.83 33.02,35.56 33.02,34.29 32.16,33.43 30.07,33.43 v29.21,34.29
POWERKEY  (via drill 0.35)
  Top 0.254: S2.1 5.33,57.15 10.16,57.15 | D5.A 42.85,19.99 39.59,19.99 39.04,19.44 39.04,16.18 37.77,14.91 33.9,14.91 33.35,14.36 33.35,10.49 29.62,6.76 29.04,6.76 28.64,6.35 20.32,6.35 20.32,7.62 15.24,12.7 10.16,12.7 9.83,13.03 9.83,13.14 9.67,13.3 9.56,13.3 5.08,17.78 v5.08,19.05 | S2.2 12.7,64.52 12.7,59.69 10.16,57.15 | 10.16,57.15 10.16,54.96 10.02,54.82 10.02,53.13 11.22,51.93 11.57,51.93 v12.7,50.8 | U3.P$8 20.98,58.15 20.98,57.81 20.32,57.15 19.05,58.42 17.78,58.42 16.51,57.15 16.51,55.88 v17.78,54.61
  Bottom 0.254: v5.08,19.05 5.08,24.13 6.35,25.4 6.35,27.94 5.08,29.21 5.08,33.02 7.95,35.89 8.01,35.89 8.56,36.44 8.56,36.5 8.89,36.83 8.89,43.18 12.7,46.99 v12.7,50.8 12.7,50.86 13.58,51.74 14.91,51.74 v17.78,54.61
POWERKEY_5V
  Top 0.254: J2.9 53.34,38.1 49.86,34.62 49.86,33.9 49.31,33.35 43.57,33.35 41.69,35.23 39.59,35.23 39.04,34.68 39.04,33.9 40.64,32.3 D5.C
POWERSTAT  (via drill 0.35)
  Top 0.152: U3.P$49 47.16,62.68 47.61,62.68 48.26,62.03 v48.26,60.96 | IC3.12 29.58,42.05 29.58,41.75 29.45,41.62 28.26,41.62 27.97,41.91 v26.67,41.91
  Bottom 0.152: v48.26,60.96 48.26,51.23 48.87,50.62 48.87,46.74 48.51,46.38 45.91,46.38 39.62,52.68 39.12,52.68 36.52,50.08
  Bottom 0.254: v26.67,41.91 30.48,45.72 30.48,46.99 33.57,50.08 36.52,50.08
POWERSTAT_5V  (via drill 0.35)
  Top 0.254: R3.1 11.43,35.56 26.67,35.56 26.67,36.83 30.48,40.64 IC3.11 30.28,42.1 30.28,41.73 29.21,40.66 v29.21,40.64 | J2.11 52.73,45.06 51.8,45.06 51.41,45.45 51.41,46.38 v50.8,46.99 | v36.83,43.18 35.56,41.91 v34.29,41.91
  Bottom 0.254: v50.8,46.99 49.62,46.99 48.66,46.03 47.3,46.03 43.18,41.91 41.93,41.91 41.86,41.99 41.83,41.99 40.64,43.18 v36.83,43.18 | v34.29,41.91 33.02,40.64 v29.21,40.64
RESET  (via drill 0.35)
  Top 0.254: U$1.D8 102.26,15.85 102.26,18.05 91.1,29.21 v80.01,29.21 | v72.39,30.48 68.58,34.29 60.07,34.29 55.09,39.27 53.93,39.27 48.95,34.29 D2.A | v21.59,30.48 v21.59,33.02 | U3.P$16 20.6,50.15 20.31,49.86 18.11,49.86 v16.51,48.26
  Bottom 0.254: v80.01,29.21 76.26,29.21 76.26,30.81 75.48,31.59 74.38,31.59 73.28,30.48 v72.39,30.48 | D2.A 46.99,35.56 38.8,35.56 38.1,34.87 38.1,31.75 36.83,30.48 33.72,30.48 32.61,29.38 32.61,28.8 27.28,23.47 20.05,23.47 19.66,23.86 19.66,24.4 20.32,25.06 20.32,26.67 21.59,27.94 v21.59,30.48 | v16.51,48.26 16.51,46.99 21.59,41.91 v21.59,33.02
RESET_5V
  Top 0.254: D2.C 46.99,27.94 J2.5
RI  (via drill 0.35)
  Top 0.254: U3.P$10 21.47,55.73 20.95,55.73 15.85,50.63 15.85,45.45 23.86,37.44 24.74,37.44 v27.94,40.64 | v31.75,39.37 31.78,39.4 IC3.9
  Bottom 0.254: v27.94,40.64 29.21,39.37 v31.75,39.37
RI_5V  (via drill 0.35)
  Top 0.254: J2.10 53.85,41.4 53.27,41.4 49.57,45.11 44.18,45.11 42.25,43.18 v41.91,43.18 | v38.1,46.99 v35.56,46.99 | v34.29,43.18 33.31,43.18 IC3.8
  Bottom 0.254: v41.91,43.18 40.64,44.45 36.83,44.45 36.83,45.72 v38.1,46.99 | v35.56,46.99 34.29,45.72 v34.29,43.18
RTS  (via drill 0.35)
  Top 0.254: R9.2 20.61,52.36 20.61,52.39 21.37,53.15 U3.P$13 24.32,53.15 v25.4,52.07 | D3.A v44.45,44.45 | v29.21,52.07 30.48,53.34 35.56,53.34 v41.91,46.99
  Bottom 0.254: v41.91,46.99 v44.45,44.45 | v25.4,52.07 v29.21,52.07
RTS_5V  (via drill 0.35)
  Top 0.254: D3.C 44.45,36.83 v49.53,36.83 | J2.8 v52.07,35.56
  Bottom 0.254: v49.53,36.83 50.8,35.56 v52.07,35.56
RXD_5V
  Top 0.254: J2.6 54.61,29.59 55.78,28.42 55.78,27.46 55.09,26.77 51.62,26.77 43.9,19.05 D4.C
SIGFOX_RX  (via drill 0.35)
  Top 0.254: U$1.D3 101.6,30.48 v97.79,27.94 | v72.39,13.97 72.39,13.53 71.71,12.84 71.71,12.57 U1.15
  Bottom 0.254: v72.39,13.97 73.05,13.31 79.01,13.31 80.67,14.97 80.67,18.87 80.88,19.07 83.07,19.07 91.93,27.94 v97.79,27.94
SIGFOX_TX  (via drill 0.35)
  Top 0.254: U1.14 70.61,11.73 70.61,11.46 71.91,10.16 v74.93,10.16 | v97.79,25.4 100.33,27.94 U$1.D4
  Bottom 0.254: v74.93,10.16 77.47,10.16 79.35,12.04 79.35,12.97 81.31,14.93 81.31,15.76 82.03,16.48 83.8,16.48 92.71,25.4 v97.79,25.4
SIM_CLCK  (via drill 0.35)
  Top 0.152: X7.C3 6.35,28.95 v6.35,31.75 | U3.P$31 39.37,44.67 v39.37,41.91
  Top 0.254: IC4.4 5.95,26.67 8.63,26.67 X7.C3
  Bottom 0.254: v39.37,41.91 39.37,41.36 39.04,41.03 39.04,40.25 39.37,39.92 39.37,38.1 39.16,37.89 38.93,37.89 37.19,36.15 37.19,33.38 35.56,31.75 v6.35,31.75
SIM_DATA  (via drill 0.35)
  Top 0.254: 33.78,25.91 33.05,25.18 33.05,23.45 34.09,22.41 35.41,22.41 35.57,22.25 35.57,20.72 35.41,20.56 33.47,20.56 28.63,25.4 v26.67,25.4 | 33.78,25.91 X7.C7 | IC4.5 4.01,24.98 4.01,24.81 4.17,24.65 4.75,24.65 5.28,25.18 20.1,25.18 v21.59,26.67 | U3.P$30 38.29,40.83 v35.56,38.1 | v35.56,35.56 36.83,34.29 36.83,26.67 35.56,25.4 34.29,25.4 33.78,25.91
  Bottom 0.254: v35.56,38.1 v35.56,35.56 | v21.59,26.67 22.86,25.4 v26.67,25.4
SIM_RST  (via drill 0.35)
  Top 0.152: X7.C2 20.21,24.02 v20.32,24.13 | v40.64,41.91 40.29,42.26 U3.P$32
  Top 0.254: IC4.3 7.79,23.08 X7.C2
  Bottom 0.254: v20.32,24.13 26.79,24.13 33.55,30.89 35.56,30.89 37.69,33.02 37.69,35.03 38.1,35.44 38.1,36.49 39.1,37.49 39.48,37.49 42.24,40.25 42.24,41.03 41.69,41.58 40.97,41.58 v40.64,41.91
TXD_5V  (via drill 0.35)
  Top 0.254: IC3.6 31.78,33.05 30.48,31.75 30.48,27.94 v31.75,26.67 | v52.07,30.48 52.07,31.75 53.34,33.02 J2.7
  Bottom 0.254: v31.75,26.67 33.02,27.94 33.02,29.21 34.63,29.21 35.29,29.87 35.83,29.87 36.49,29.21 50.8,29.21 v52.07,30.48
UART_RXD  (via drill 0.35)
  Top 0.254: D4.A 48.26,20.32 v49.53,21.59 | v35.56,29.21 35.56,34.29 v34.29,35.56 | v20.32,50.8 20.67,51.15 U3.P$15 | v99.06,24.13 102.21,20.98 102.21,20.05 102.6,19.66 103.14,19.66 103.8,20.32 U$1.D5
  Bottom 0.254: v35.56,29.21 39.04,25.73 39.04,25.01 42.46,21.59 v49.53,21.59 63.5,21.59 66.04,24.13 68.58,24.13 71.09,26.64 90.06,26.64 92.01,28.6 98.06,28.6 98.45,28.21 98.45,24.74 v99.06,24.13 | v20.32,50.8 20.32,49.53 26.01,43.84 26.01,41.64 29.55,38.1 34.29,38.1 34.29,37.76 34.95,37.1 34.95,36.56 34.29,35.9 v34.29,35.56
UART_TXD  (via drill 0.35)
  Top 0.254: U3.P$14 21.97,52.07 v24.13,52.07 | v27.94,33.02 29.21,33.02 29.21,31.75 | IC3.5 31.13,33.67 29.21,31.75 | v30.48,25.4 29.21,26.67 29.21,31.75 | v104.14,19.05 U$1.D6
  Bottom 0.254: v27.94,33.02 24.13,36.83 24.13,41.36 25.12,42.35 25.12,44.16 19.41,49.86 18.66,49.86 18.11,50.41 18.11,51.19 18.66,51.74 23.8,51.74 v24.13,52.07 | v30.48,25.4 31.75,24.13 39.35,24.13 42.54,20.93 49.26,20.93 51.04,19.15 61.64,19.15 66.21,23.72 69.33,23.72 71.73,21.32 71.73,12.43 77.78,6.38 83.07,6.38 83.8,7.1 83.8,7.59 86.36,10.16 90.51,10.16 91.17,9.5 94.59,9.5 v104.14,19.05
VBAT  (via drill 0.35)
  Top 0.254: U3.P$6 U3.P$5 U3.P$4 19.13,62.15 v17.78,63.5 | IC2.3 53.34,8.57 | 53.34,8.57 54.93,8.57 56.15,7.35 CN3.2 | D6.C 74.93,33.64 C13.1 C12.1 C11.1 | v52.07,16.51 52.07,17.78 J2.2 59.69,20.32 v62.23,22.86 | v52.07,10.16 53.34,8.89 53.34,8.57 | C11.1 56.91,39.99 55.09,41.81 53.44,41.81 v48.26,46.99 | v59.69,38.1 58.42,39.37 C11.1
  Bottom 0.254: v52.07,16.51 52.07,16.17 52.73,15.51 52.73,14.97 52.07,14.31 v52.07,10.16 | v48.26,46.99 31.75,63.5 v17.78,63.5 | v62.23,22.86 62.23,35.56 v59.69,38.1
VRTC
  Top 0.254: C10.1 20.56,49.15 U3.P$17
VSS
  Top 0.254: IC2.2 R7.1
WISOL_RF  (via drill 0.35)
  Top 0.254: v63.5,17.78 62.23,19.05 59.69,19.05 58.87,18.23 58.43,18.23 58.27,18.07 58.27,17.88 C3.1 | v69.85,21.59 72.26,24 U1.30
  Bottom 0.254: v63.5,17.78 66.04,17.78 v69.85,21.59